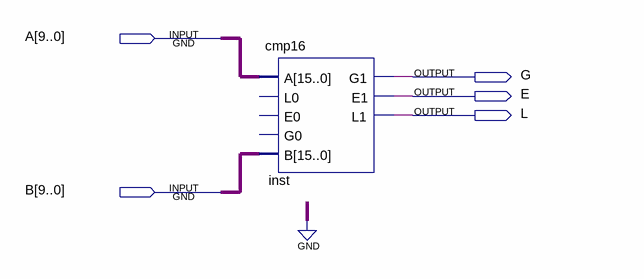
[diagram p0: schematic sheet]
// Quartus schematic cmp10u.bdf as structural Verilog: 1 symbols, 5 pins
module cmp10u (
  input  [9:0] A,
  input  [9:0] B,
  output G,
  output E,
  output L
);

  cmp16 inst (.A({{6{1'b0}}, A}), .B({{6{1'b0}}, B}), .G1(G), .E1(E), .L1(L));  // open: L0, E0, G0
endmodule
